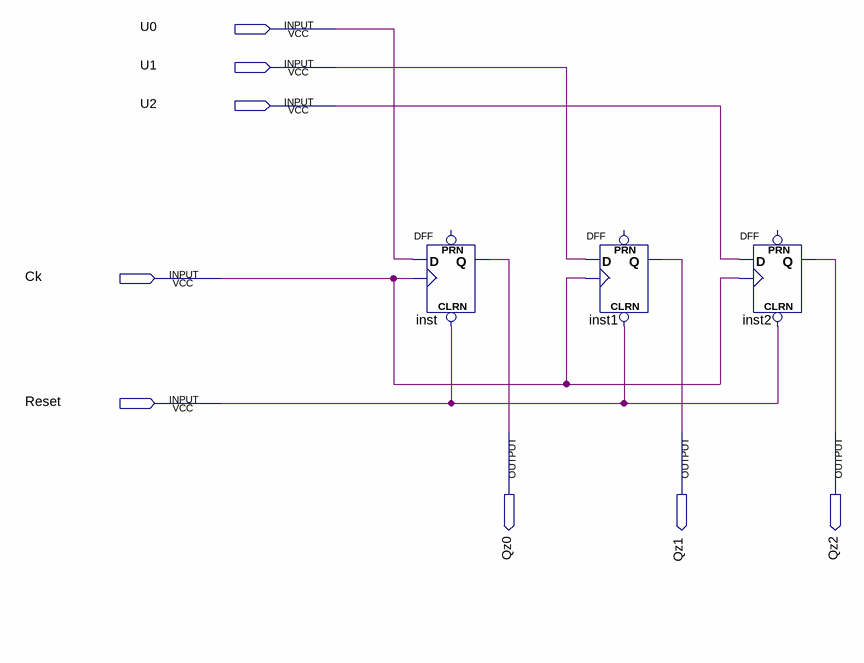
[diagram p0: schematic sheet]
// Quartus schematic Reg3bits.bdf as structural Verilog: 3 symbols, 8 pins
module Reg3bits (
  input  U0,
  input  U1,
  input  U2,
  input  Ck,
  input  Reset,
  output Qz0,
  output Qz1,
  output Qz2
);

  DFF inst (.CLRN(Reset), .CLK(Ck), .D(U0), .Q(Qz0));  // open: PRN
  DFF inst1 (.CLRN(Reset), .CLK(Ck), .D(U1), .Q(Qz1));  // open: PRN
  DFF inst2 (.CLRN(Reset), .CLK(Ck), .D(U2), .Q(Qz2));  // open: PRN
endmodule
